# EAGLE design gs_mainboard_3 (EAGLE 7.5.0)
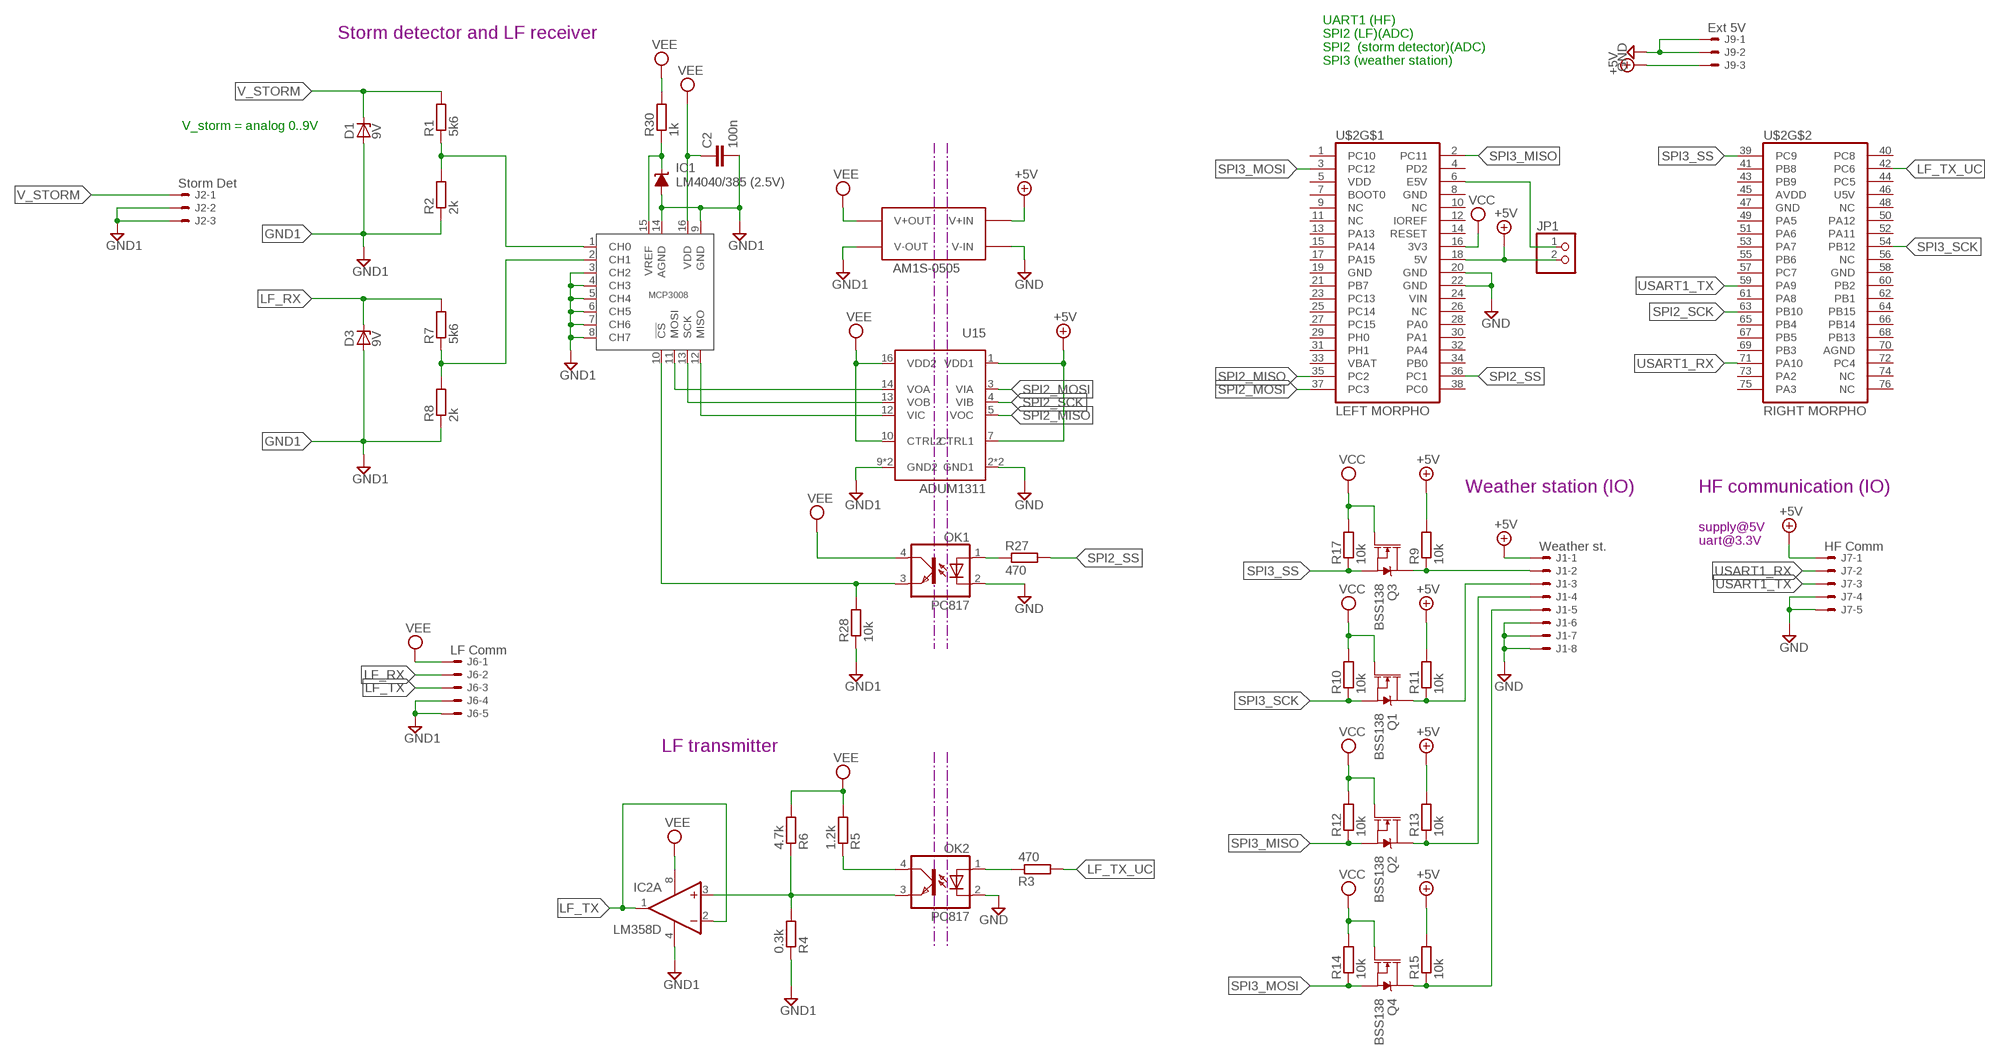
[diagram p0: schematic, sheet 1]

## Parts
C2  100n  C-EUC0805  [C0805]
D1  9V  ZENER-DIODESOT23  [SOT23]
D3  9V  ZENER-DIODESOT23  [SOT23]
IC1  LM4040/385 (2.5V)  LM4041A12DBZ  [DBZ_R-PDSO-G3]
IC2  LM358D  [SO08]
J1  Weather st.  22-05-7088-08  [7395-08]
J2  Storm Det  22-05-7038-03  [7395-03]
J6  LF Comm  22-05-7058-05  [7395-05]
J7  HF Comm  22-05-7058-05  [7395-05]
J9  Ext 5V  22-05-7038-03  [7395-03]
JP1  PINHD-1X2  [1X02]
OK1  PC817  [DIL04]
OK2  PC817  [DIL04]
Q1  BSS138  MOSFET-NCH-AO3404A  [SOT23-3]
Q2  BSS138  MOSFET-NCH-AO3404A  [SOT23-3]
Q3  BSS138  MOSFET-NCH-AO3404A  [SOT23-3]
Q4  BSS138  MOSFET-NCH-AO3404A  [SOT23-3]
R1  5k6  R-EU_R0805  [R0805]
R2  2k  R-EU_R0805  [R0805]
R3  470  R-EU_M0805  [M0805]
R4  0.3k  R-EU_M0805  [M0805]
R5  1.2k  R-EU_M0805  [M0805]
R6  4.7k  R-EU_M0805  [M0805]
R7  5k6  R-EU_R0805  [R0805]
R8  2k  R-EU_R0805  [R0805]
R9  10k  R-EU_M0805  [M0805]
R10  10k  R-EU_M0805  [M0805]
R11  10k  R-EU_M0805  [M0805]
R12  10k  R-EU_M0805  [M0805]
R13  10k  R-EU_M0805  [M0805]
R14  10k  R-EU_M0805  [M0805]
R15  10k  R-EU_M0805  [M0805]
R17  10k  R-EU_M0805  [M0805]
R27  470  R-EU_M0805  [M0805]
R28  10k  R-EU_M0805  [M0805]
R30  1k  R-EU_M0805  [M0805]
U13  MCP3008SL  [SO16]
U15  ADUM1311  [SOIC-16W]
U$2  NUCLEO_F411RE_MORPHO  [MORPHO_HEADERS]
U$14  AM1S-0505  [SIP4]

## Nets
+5V: J1.1 J7.1 J9.3 JP1.2 R9.2 R11.2 R13.2 R15.2 U15.1(VDD1) U15.7(CTRL1) U$2.18(5V) U$14.P$2(V+IN)
E5V: JP1.1 U$2.6(E5V)
GND: J1.6 J1.7 J1.8 J7.4 J7.5 J9.1 J9.2 OK1.2(C) OK2.2(C) U15.2(GND1) U15.8(GND1) U$2.20(GND) U$2.22(GND) U$14.P$1(V-IN)
GND1: C2.2 D1.1(A) D3.1(A) IC1.2(A) IC2.4(P:V-) J2.2 J2.3 J6.4 J6.5 R2.1 R4.1 R8.1 R28.1 U13.3(CH2) U13.4(CH3) U13.5(CH4) U13.6(CH5) U13.7(CH6) U13.8(CH7) U13.9(GND) U13.14(AGND) U15.9(GND2) U15.15(GND2) U$14.P$3(V-OUT)
LF_RX: D3.3(C) J6.2 R7.2
LF_TX: IC2.1(A:OUT) IC2.2(A:-IN) J6.3
LF_TX1: IC2.3(A:+IN) OK2.3(EMIT) R4.2 R6.1
LF_TX_UC: R3.2 U$2.42(PC6)
N$2: R7.1 R8.2 U13.2(CH1)
N$3: OK2.1(A) R3.1
N$5: OK2.4(COL) R5.1
N$7: R1.1 R2.2 U13.1(CH0)
N$18: IC1.1(C) R30.1 U13.15(VREF)
N$19: OK1.1(A) R27.1
N$21: OK1.3(EMIT) R28.2 U13.10(!CS)
N$23: U13.11(MOSI) U15.14(VOA)
N$24: U13.13(SCK) U15.13(VOB)
N$25: U13.12(MISO) U15.12(VIC)
SPI2_MISO: U15.5(VOC) U$2.35(PC2)
SPI2_MOSI: U15.3(VIA) U$2.37(PC3)
SPI2_SCK: U15.4(VIB) U$2.63(PB10)
SPI2_SS: R27.2 U$2.36(PC1)
SPI3_MISO: Q2.2(S) R12.1 U$2.2(PC11)
SPI3_MISO_EXT: J1.4 Q2.3(D) R13.1
SPI3_MOSI: Q4.2(S) R14.1 U$2.3(PC12)
SPI3_MOSI_EXT: J1.5 Q4.3(D) R15.1
SPI3_SCK: Q1.2(S) R10.1 U$2.54(PB12)
SPI3_SCK_EXT: J1.3 Q1.3(D) R11.1
SPI3_SS: Q3.2(S) R17.1 U$2.39(PC9)
SPI3_SS_EXT: J1.2 Q3.3(D) R9.1
USART1_RX: J7.2 U$2.71(PA10)
USART1_TX: J7.3 U$2.59(PA9)
V_STORM: D1.3(C) J2.1 R1.2
VCC: Q1.1(G) Q2.1(G) Q3.1(G) Q4.1(G) R10.2 R12.2 R14.2 R17.2 U$2.16(3V3)
VEE: C2.1 IC2.8(P:V+) J6.1 OK1.4(COL) R5.2 R6.2 R30.2 U13.16(VDD) U15.10(CTRL2) U15.16(VDD2) U$14.P$4(V+OUT)
Unconnected: IC2.5(B:+IN) IC2.6(B:-IN) IC2.7(B:OUT) U$2.1(PC10) U$2.4(PD2) U$2.7(BOOT0) U$2.9(NC) U$2.10(NC) U$2.11(NC) U$2.12(IOREF) U$2.13(PA13) U$2.14(RESET) U$2.15(PA14) U$2.17(PA15) U$2.21(PB7) U$2.23(PC13) U$2.25(PC14) U$2.26(NC) U$2.27(PC15) U$2.28(PA0) U$2.29(PH0) U$2.30(PA1) U$2.31(PH1) U$2.32(PA4) U$2.34(PB0) U$2.38(PC0) U$2.40(PC8) U$2.41(PB8) U$2.43(PB9) U$2.44(PC5) U$2.48(NC) U$2.49(PA5) U$2.50(PA12) U$2.51(PA6) U$2.52(PA11) U$2.53(PA7) U$2.55(PB6) U$2.56(NC) U$2.57(PC7) U$2.60(PB2) U$2.61(PA8) U$2.62(PB1) U$2.64(PB15) U$2.65(PB4) U$2.66(PB14) U$2.67(PB5) U$2.68(PB13) U$2.69(PB3) U$2.72(PC4) U$2.73(PA2) U$2.74(NC) U$2.75(PA3) U$2.76(NC)

## Notes on the sheet
- Storm detector and LF receiver
- UART1 (HF)
  SPI2 (LF)(ADC)
  SPI2  (storm detector)(ADC)
  SPI3 (weather station)
- V_storm = analog 0..9V
- Weather station (IO) | HF communication (IO)
- supply@5V 
  uart@3.3V
- LF transmitter

## Power pins joined to a net without a drawn wire
AGND: U$2.70(AGND)
AVDD: U$2.45(AVDD)
GND: U$2.8(GND) U$2.19(GND) U$2.47(GND) U$2.58(GND)
U5V: U$2.46(U5V)
VBAT: U$2.33(VBAT)
VDD: U$2.5(VDD)
VIN: U$2.24(VIN)

## Library data of the parts
C2 = rcl:C-EU: CAPACITOR, European symbol
D1 D3 = diode:ZENER-DIODE: Z-Diode
IC1 = texas:LM4041: PRECISION MICROPOWER SHUNT VOLTAGE REFERENCE Source: http://focus.ti.com/lit/ds/slcs146e/slcs146e.pdf; MPN: LM4041A12IDBZR; OC_FARNELL: 1407949; OC_NEWARK: 58K5875
IC2 = linear:LM358: OP AMP also LM158; LM258; LM2904 Source: http://cache.national.com/ds/LM/LM158.pdf
J1 = EP_molex_6410_7395:22-?-08: CONNECTOR wire to board 2.54 mm (.1 inch) pitch header
J2 J9 = EP_molex_6410_7395:22-?-03: CONNECTOR wire to board 2.54 mm (.1 inch) pitch header
J6 J7 = EP_molex_6410_7395:22-?-05: CONNECTOR wire to board 2.54 mm (.1 inch) pitch header
JP1 = pinhead:PINHD-1X2: PIN HEADER
OK1 OK2 = optocoupler:PC817: SHARP OPTO COUPLER; MPN: PC817X4J000F; OC_FARNELL: 9707727; OC_NEWARK: 97K7059
Q1-Q4 = SparkFun-DiscreteSemi:MOSFET-NCH: N-channel MOSFETs Voltage controlled devices that allow control of high current outputs. SparkFun Products: SparkFun OpenScale <https://www.sparkfun.com/products/13261> SparkFun Digital Sandbox <https://www.sparkfun.com/products/12651> SparkFun Monster Moto Shield <https://www.sparkfun.com/products/10182> SparkFun MOSFET Power Controller <https://www.sparkfun.com/products/11214>; PROD_ID: TRANS-12988; VALUE: 5.8A/30V/35mΩ
R1-R15 R17 R27 R28 R30 = rcl:R-EU_: RESISTOR, European symbol
U13 = MCP300x:MCP3008
U15 = adum:ADUM1311
U$2 = stm32_nucleo_shield:NUCLEO_F411RE_MORPHO
U$14 = am1s:AM1S-0505

## Board
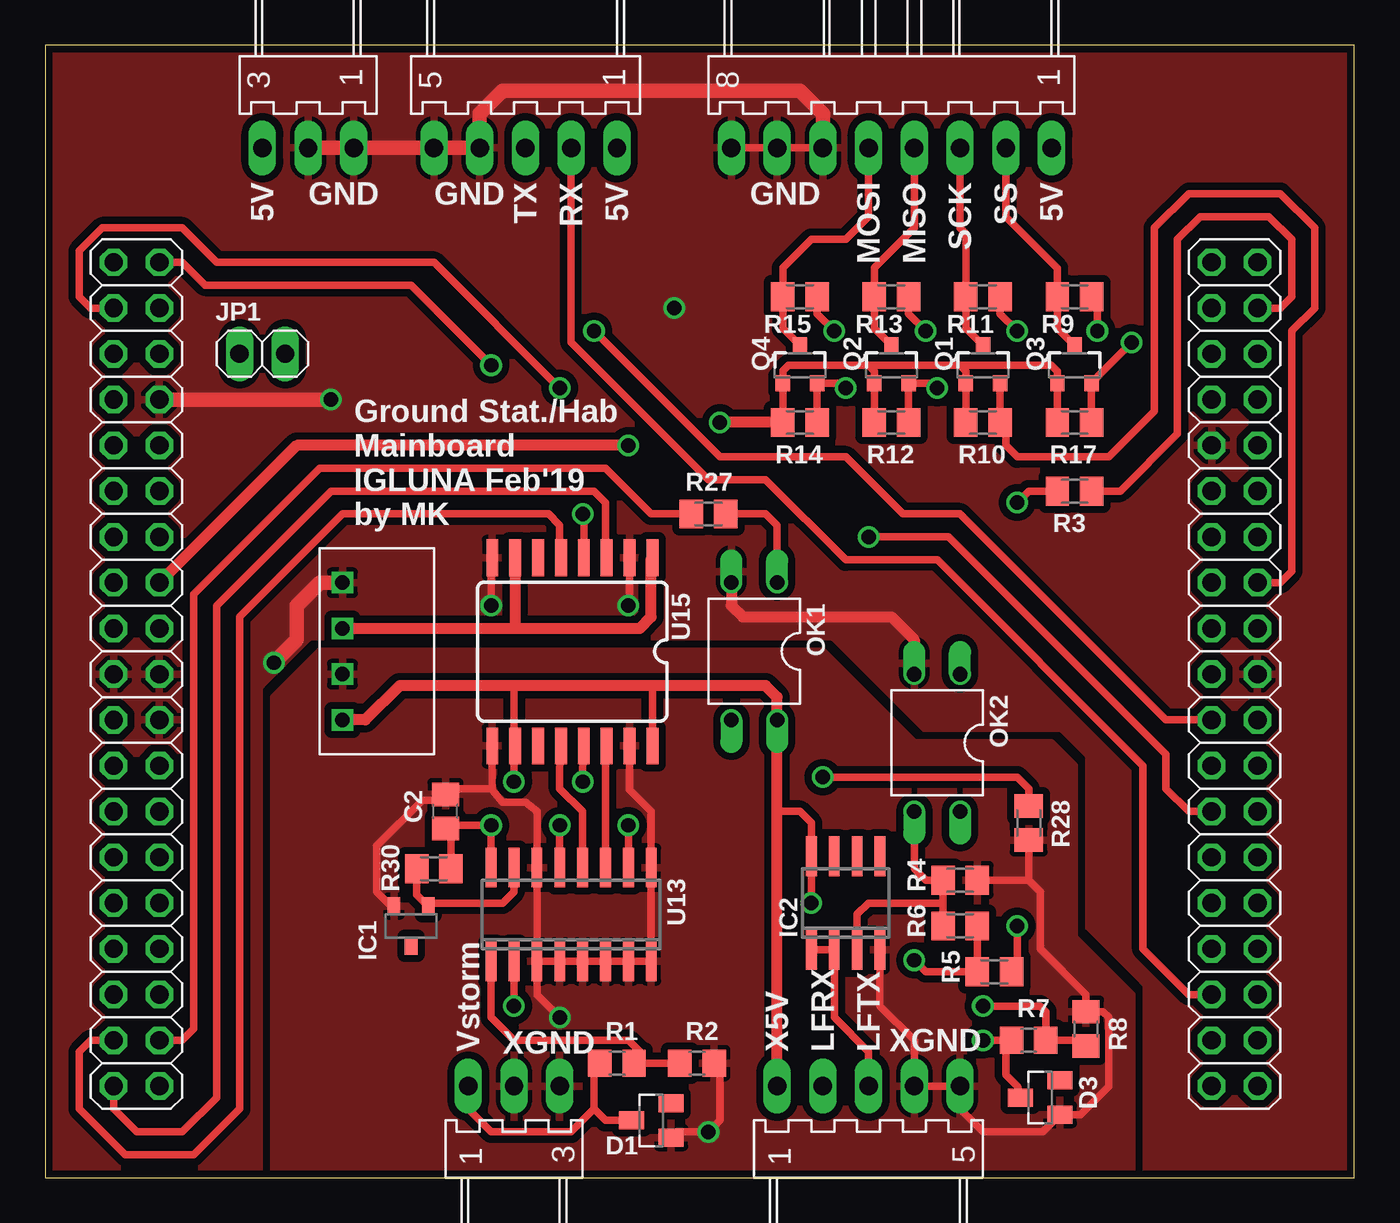
[diagram p1: board, top side]
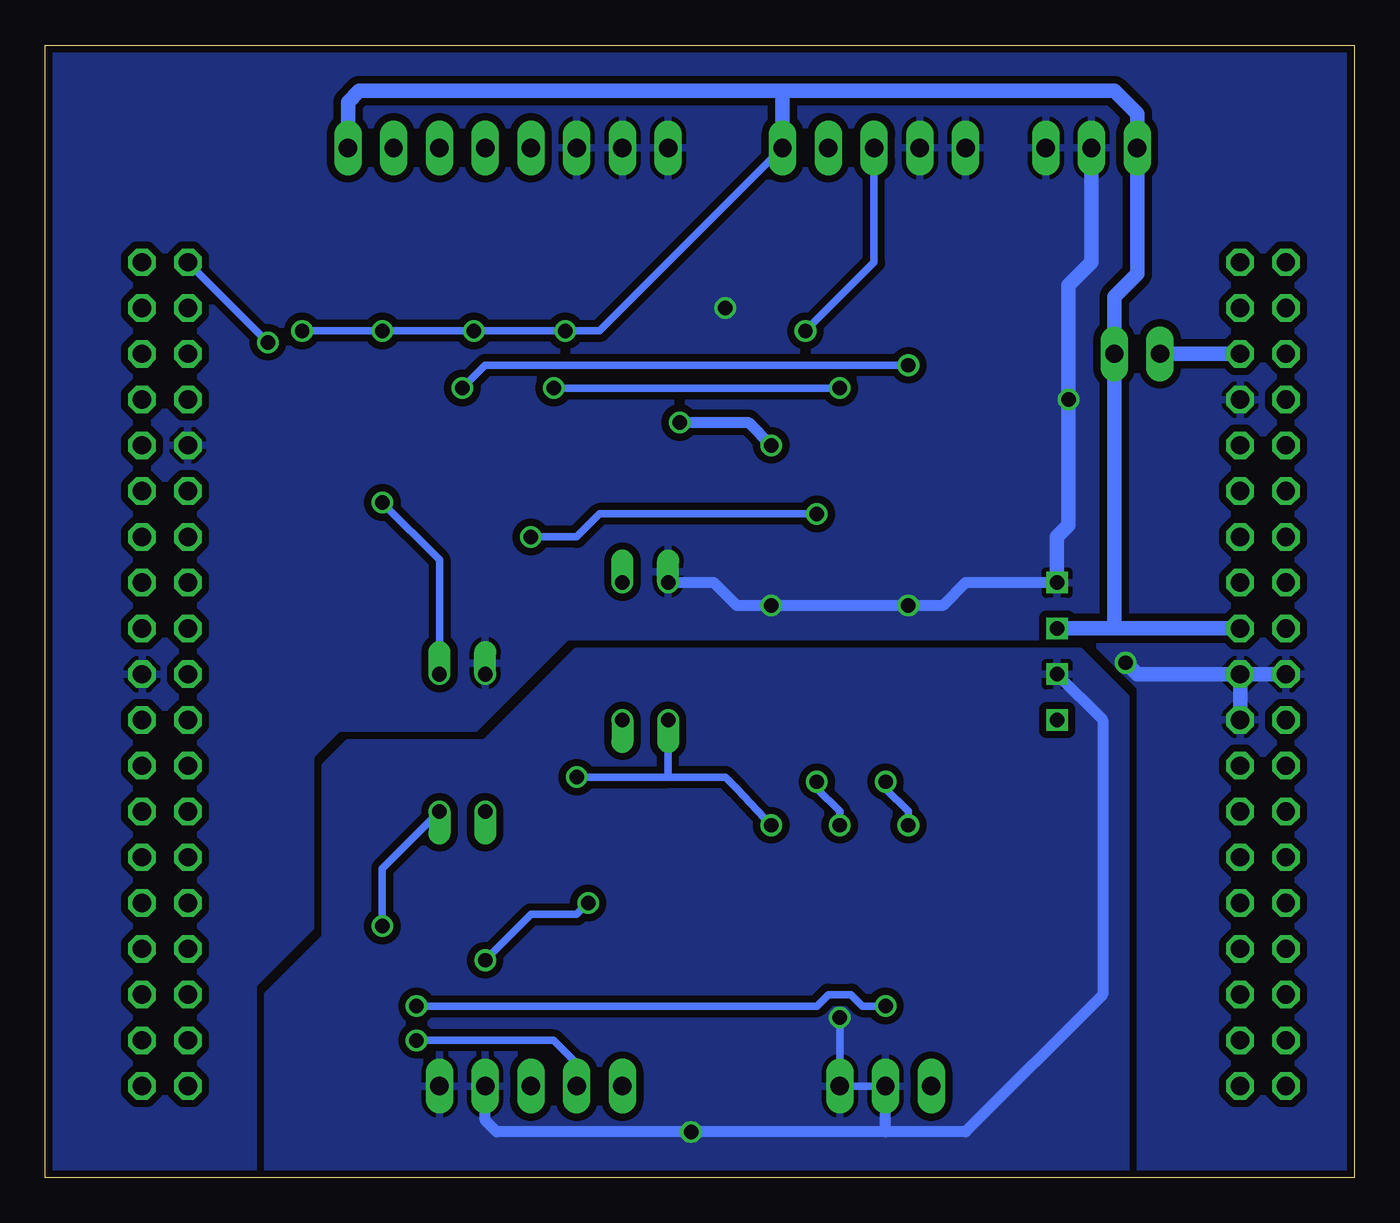
[diagram p2: board, bottom side, seen from below]

Size 72.69 x 62.85 mm. Coordinates in mm from the lower left corner, seen from the top.
Outline: 0,0 72.69,0 72.69,62.85 0,62.85 0,0
Copper layers (1*16): Top 0.035mm / dielectric 1.5mm / Bottom 0.035mm
Design rules "jlcpcb_rules": minimum track width 5mil, minimum drill 0.2mm, track to track 5mil, track to pad 5mil, pad to pad 5mil, via to via 5mil, smd to smd 5mil, copper to edge 0.2mm, drill to drill 12mil, minimum pad ring 3mil, minimum via ring 3mil, stop-mask expansion 4mil, vias tented up to drill 0mil, thermal gap 10mil

### Footprints (pad centres in the part's own frame; a part is rotated, then mirrored left to right if it is on the bottom)
C0805 = smd 1.3 x 1.5: 1 -0.95,0; 2 0.95,0
SOT23 = smd 1 x 1.4: 1 -0.95,-1.1; 2 0.95,-1.1; 3 0,1.1
DBZ_R-PDSO-G3 = smd 0.7 x 1: 1 -0.95,-1.1; 2 0.95,-1.1; 3 0,1.1
SO08 = smd 0.6 x 2.2: 1 -1.905,-2.6; 2 -0.635,-2.6; 3 0.635,-2.6; 4 1.905,-2.6; 5 1.905,2.6; 6 0.635,2.6; 7 -0.635,2.6; 8 -1.905,2.6
7395-08 = drill 1.016 long: 1 8.89,0; 2 6.35,0; 3 3.81,0; 4 1.27,0; 5 -1.27,0; 6 -3.81,0; 7 -6.35,0; 8 -8.89,0
7395-03 = drill 1.016 long: 1 2.54,0; 2 0,0; 3 -2.54,0
7395-05 = drill 1.016 long: 1 5.08,0; 2 2.54,0; 3 0,0; 4 -2.54,0; 5 -5.08,0
1X02 = drill 1.016 long: 1 -1.27,0; 2 1.27,0
DIL04 = drill 0.813 offset: 1 -1.27,-3.81; 2 1.27,-3.81; 3 1.27,3.81; 4 -1.27,3.81
SOT23-3 = smd 0.8 x 0.9: 1 -0.95,-1; 2 0.95,-1; 3 0,1.1
R0805 = smd 1.3 x 1.5: 1 -0.95,0; 2 0.95,0
M0805 = smd 1.3 x 1.6: 1 -0.95,0; 2 0.95,0
SO16 = smd 0.6 x 2.2: 1 -4.445,-2.6; 2 -3.175,-2.6; 3 -1.905,-2.6; 4 -0.635,-2.6; 5 0.635,-2.6; 6 1.905,-2.6; 7 3.175,-2.6; 8 4.445,-2.6; 9 4.445,2.6; 10 3.175,2.6; 11 1.905,2.6; 12 0.635,2.6; 13 -0.635,2.6; 14 -1.905,2.6; 15 -3.175,2.6; 16 -4.445,2.6
SOIC-16W = smd 0.66 x 2.032: 1 -1.335,-3.285; 2 -0.065,-3.285; 3 1.205,-3.285; 4 2.475,-3.285; 5 3.745,-3.285; 6 5.015,-3.285; 7 6.285,-3.285; 8 7.555,-3.285; 9 7.555,7.155; 10 6.285,7.155; 11 5.015,7.155; 12 3.745,7.155; 13 2.475,7.155; 14 1.205,7.155; 15 -0.065,7.155; 16 -1.335,7.155
MORPHO_HEADERS = drill 1.016 octagon: 1 -31.75,22.86; 2 -29.21,22.86; 3 -31.75,20.32; 4 -29.21,20.32; 5 -31.75,17.78; 6 -29.21,17.78; 7 -31.75,15.24; 8 -29.21,15.24; 9 -31.75,12.7; 10 -29.21,12.7; 11 -31.75,10.16; 12 -29.21,10.16; 13 -31.75,7.62; 14 -29.21,7.62; 15 -31.75,5.08; 16 -29.21,5.08; 17 -31.75,2.54; 18 -29.21,2.54; 19 -31.75,0; 20 -29.21,0; 21 -31.75,-2.54; 22 -29.21,-2.54; 23 -31.75,-5.08; 24 -29.21,-5.08; 25 -31.75,-7.62; 26 -29.21,-7.62; 27 -31.75,-10.16; 28 -29.21,-10.16; 29 -31.75,-12.7; 30 -29.21,-12.7; 31 -31.75,-15.24; 32 -29.21,-15.24; 33 -31.75,-17.78; 34 -29.21,-17.78; 35 -31.75,-20.32; 36 -29.21,-20.32; 37 -31.75,-22.86; 38 -29.21,-22.86; 39 29.21,22.86; 40 31.75,22.86; 41 29.21,20.32; 42 31.75,20.32; 43 29.21,17.78; 44 31.75,17.78; 45 29.21,15.24; 46 31.75,15.24; 47 29.21,12.7; 48 31.75,12.7; 49 29.21,10.16; 50 31.75,10.16; 51 29.21,7.62; 52 31.75,7.62; 53 29.21,5.08; 54 31.75,5.08; 55 29.21,2.54; 56 31.75,2.54; 57 29.21,0; 58 31.75,0; 59 29.21,-2.54; 60 31.75,-2.54; 61 29.21,-5.08; 62 31.75,-5.08; 63 29.21,-7.62; 64 31.75,-7.62; 65 29.21,-10.16; 66 31.75,-10.16; 67 29.21,-12.7; 68 31.75,-12.7; 69 29.21,-15.24; 70 31.75,-15.24; 71 29.21,-17.78; 72 31.75,-17.78; 73 29.21,-20.32; 74 31.75,-20.32; 75 29.21,-22.86; 76 31.75,-22.86
SIP4 = drill 0.8 square: P$1 1.27,0; P$2 3.81,0; P$3 6.35,0; P$4 8.89,0

### Placement (x,y rotation side)
C2  22.23,20.32 90 top
D1  33.66,3.17 90 top
D3  55.24,4.45 90 top
IC1  20.32,13.97 180 top
IC2  44.45,15.24 0 top
J1  46.99,57.15 0 top
J2  26.04,5.08 180 top
J6  45.72,5.08 180 top
J7  26.67,57.15 0 top
J9  14.61,57.15 0 top
JP1  12.06,45.72 0 top
OK1  39.37,29.21 180 top
OK2  49.53,24.13 180 top
Q1  52.07,45.09 0 top
Q2  46.99,45.09 0 top
Q3  57.15,45.09 0 top
Q4  41.91,45.09 0 top
R1  31.75,6.35 180 top
R2  36.2,6.35 180 top
R3  57.15,38.1 0 top
R4  50.8,16.51 180 top
R5  52.7,11.43 180 top
R6  50.8,13.97 0 top
R7  54.61,7.62 180 top
R8  57.78,8.26 270 top
R9  57.15,48.9 0 top
R10  52.07,41.91 180 top
R11  52.07,48.9 0 top
R12  46.99,41.91 180 top
R13  46.99,48.9 0 top
R14  41.91,41.91 180 top
R15  41.91,48.9 0 top
R17  57.15,41.91 180 top
R27  36.83,36.83 180 top
R28  54.61,19.68 90 top
R30  21.59,17.14 0 top
U13  29.21,14.61 0 top
U15  32.38,31.11 180 top
U$2  35.56,27.94 0 top
U$14  16.51,34.29 270 top

### Tracks (layer width: path | path; a pad name or v marks a point on that pad's centre or on a via)
+5V  (via drill 0.8)
  Top 0.406: 33.66,34.34 U15.1 | 26.1,30.55 26.04,30.48 | R15.2 42.86,47.95 v43.81,46.99 | v58.42,46.99 58.42,48.58 R9.2 | R13.2 47.94,47.95 v48.9,46.99 | R11.2 53.02,47.95 v53.98,46.99
  Top 0.61: 33.66,34.34 33.66,31.11 33.02,30.48 26.04,30.48 U$14.P$2 | U15.7 26.1,30.55
  Bottom 0.406: v58.42,46.99 v53.98,46.99 v48.9,46.99 v43.81,46.99 41.91,46.99 J7.1
  Bottom 0.813: U$14.P$2 13.34,30.48 | 13.34,30.48 U$2.18 | J1.1 55.88,59.69 55.24,60.33 31.75,60.33 | 13.34,30.48 JP1.2 13.34,48.9 12.06,50.16 J9.3 12.06,59.05 13.34,60.33 31.75,60.33 | 31.75,60.33 J7.1
E5V
  Bottom 0.813: U$2.6 JP1.1
GND  (via drill 0.8)
  Top 0.406: 24.72,34.29 24.77,34.34 | U15.2 32.45,31.82 | v24.77,31.75 24.77,34.34 | 24.77,34.34 U15.8 | J1.6 J1.7 J1.8
  Top 0.61: OK1.2 38.1,31.75 38.73,31.11 46.99,31.11 48.26,29.84 OK2.2
  Top 0.813: v12.7,28.57 13.97,29.84 13.97,31.75 15.24,33.02 U$14.P$1 | J9.2 J7.4 24.13,59.05 25.4,60.33 41.91,60.33 43.18,59.05 J1.6 | U$2.8 v15.88,43.18
  Bottom 0.61: OK1.2 35.56,33.02 34.29,31.75 22.86,31.75 21.59,33.02 U$14.P$1
  Bottom 0.813: U$2.20 12.06,27.94 v12.7,28.57 | U$2.19 U$2.20 | U$2.22 U$2.20 | J9.2 14.61,50.8 15.88,49.53 v15.88,43.18 15.88,36.2 16.51,35.56 U$14.P$1
  other vias: 32.38,31.75 34.92,48.26
  pour Bottom (isolate 0.406, rank 6): 0,0 0,62.87 73.03,62.87 73.03,0
  pour Top (isolate 0.406, rank 6): 0,0 0,62.87 73.03,62.87 73.03,0
GND1  (via drill 0.8)
  Top 0.406: IC2.4 46.35,9.53 48.26,7.62 J6.4 J6.5 50.8,3.81 52.07,2.54 55.39,2.54 D3.1 57.47,3.5 59.05,5.08 59.05,8.89 58.74,9.21 R8.1 57.78,10.16 55.24,12.7 55.24,15.88 54.61,16.51 | R4.1 54.61,16.51 | 54.61,16.51 R28.1 | v28.57,8.89 27.3,10.16 U13.3 | 27.3,15.88 U13.14 | U13.14 U13.3 | U15.15 32.45,21.52 33.66,20.32 U13.9 U13.8 U13.7 U13.6 U13.5 U13.4 U13.3 | U15.9 24.83,21.52 25.4,20.83 26.67,20.83 27.3,20.32 U13.14 | 37.47,6.67 R2.1 37.47,6.03 37.47,3.17 v36.83,2.54 35.07,2.54 D1.1 | 24.77,21.59 22.23,21.59 | IC1.2 19.22,15.07 18.41,15.88 18.41,18.41 20.95,20.95 21.91,20.95 C2.2
  Top 0.61: 22.23,21.59 C2.2
  Bottom 0.406: J2.2 J2.3 v28.57,8.89
  Bottom 0.61: 26.04,2.54 21.59,2.54 13.97,10.16 13.97,25.4 U$14.P$3 | 26.04,2.54 47.62,2.54 48.26,3.17 J6.4 | 26.04,2.54 J2.2
  pour Bottom (isolate 0.406): 12.7,0 12.7,26.67 15.24,29.21 43.18,29.21 48.26,24.13 55.88,24.13 57.15,22.86 57.15,13.34 60.33,10.16 60.33,0
  pour Top (isolate 0.406): 12.7,0 12.7,26.67 15.24,29.21 43.18,29.21 48.26,24.13 55.88,24.13 57.15,22.86 57.15,13.34 60.33,10.16 60.33,0
LF_RX  (via drill 0.8)
  Top 0.406: D3.3 53.98,5.08 53.34,5.71 53.34,7.3 R7.2 | v52.07,7.62 R7.2 | 53.98,7.62 R7.2
  Bottom 0.406: J6.2 43.18,6.35 44.45,7.62 v52.07,7.62
LF_TX
  Top 0.406: J6.3 45.72,6.99 43.81,8.89 IC2.2 IC2.1
LF_TX1
  Top 0.406: 49.85,15.24 R4.2 48.9,16.51 48.26,17.14 OK2.3 | 49.85,15.24 R6.1 | IC2.3 45.09,14.61 45.72,15.24 49.85,15.24
LF_TX_UC
  Top 0.406: U$2.42 68.58,48.26 69.22,48.9 69.22,52.07 67.94,53.34 64.14,53.34 62.87,52.07 62.87,41.27 59.69,38.1 R3.2
N$2  (via drill 0.8)
  Top 0.406: v52.07,9.53 55.24,9.53 55.56,9.21 R7.1 57.47,7.62 R8.2 | U13.2 v26.04,9.53
  Bottom 0.406: v52.07,9.53 29.84,9.53 29.21,10.16 27.94,10.16 27.3,9.53 v26.04,9.53
N$3  (via drill 0.8)
  Top 0.406: R3.1 54.61,38.1 v53.98,37.47
  Bottom 0.406: v53.98,37.47 50.8,34.29 OK2.1
N$5  (via drill 0.8)
  Top 0.406: v53.98,13.97 53.98,11.75 R5.1
  Bottom 0.406: OK2.4 53.98,17.14 v53.98,13.97
N$7
  Top 0.406: R2.2 R1.1 33.02,6.67 33.02,6.99 32.38,7.62 26.04,7.62 24.77,8.89 U13.1
N$18
  Top 0.406: U13.15 26.04,15.88 25.4,15.24 21.44,15.24 IC1.1 20.64,15.7 R30.1
N$19
  Top 0.406: R27.1 40.01,36.83 40.64,36.2 OK1.1
N$21  (via drill 0.8)
  Top 0.406: U13.10 v32.38,19.56 | R28.2 54.61,21.59 53.98,22.23 v43.18,22.23
  Bottom 0.406: v32.38,19.56 34.29,21.59 34.92,22.23 38.1,22.23 | 38.1,22.23 OK1.3 | v43.18,22.23 38.1,22.23
N$23
  Top 0.406: U13.11 31.11,22.62 U15.14
N$24  (via drill 0.8)
  Top 0.406: U13.13 v28.57,19.56 | v29.84,21.97 29.84,22.62 U15.13
  Bottom 0.406: v28.57,19.56 28.57,20.32 29.84,21.59 v29.84,21.97
N$25
  Top 0.406: U13.12 29.84,20.32 28.57,21.59 28.57,22.62 U15.12
SPI2_MISO
  Top 0.406: U$2.35 2.54,7.62 1.91,6.99 1.91,3.81 4.45,1.27 8.26,1.27 10.79,3.81 10.79,31.11 16.51,36.83 27.94,36.83 28.57,36.2 28.57,34.47 U15.5
SPI2_MOSI
  Top 0.406: U$2.37 3.81,3.81 5.08,2.54 7.62,2.54 9.53,4.45 9.53,31.75 15.88,38.1 30.48,38.1 31.11,37.47 31.11,34.47 U15.3
SPI2_SCK  (via drill 0.8)
  Top 0.406: U$2.63 63.5,20.32 62.23,21.59 62.23,23.5 50.16,35.56 v45.72,35.56 | U15.4 29.91,36.26 v29.84,36.83
  Bottom 0.406: v29.84,36.83 41.91,36.83 43.18,35.56 v45.72,35.56
SPI2_SS
  Top 0.406: U$2.36 7.62,7.62 8.26,8.26 8.26,32.38 15.24,39.37 31.11,39.37 33.66,36.83 R27.2
SPI3_MISO  (via drill 0.8)
  Top 0.406: R12.1 Q2.2 49.26,44.09 v49.53,43.81 | U$2.2 7.62,50.8 8.89,49.53 20.32,49.53 v24.77,45.09
  Bottom 0.406: v49.53,43.81 48.26,45.09 v24.77,45.09
SPI3_MISO_EXT
  Top 0.406: Q2.3 46.04,47.13 R13.1 46.04,50.48 48.26,52.7 J1.4
SPI3_MOSI  (via drill 0.8)
  Top 0.406: R14.1 Q4.2 44.18,44.09 v44.45,43.81 | v28.57,43.81 21.59,50.8 9.53,50.8 7.62,52.7 3.17,52.7 1.91,51.44 1.91,48.9 2.54,48.26 U$2.3
  Bottom 0.406: v44.45,43.81 v28.57,43.81
SPI3_MOSI_EXT
  Top 0.406: Q4.3 40.96,47.13 R15.1 40.96,50.48 42.55,52.07 44.45,52.07 45.72,53.34 J1.5
SPI3_SCK
  Top 0.406: Q1.2 R10.1 53.34,41.59 53.34,40.64 53.98,40.01 59.05,40.01 61.59,42.55 61.59,52.7 63.5,54.61 68.58,54.61 70.48,52.7 70.48,48.26 69.22,46.99 69.22,33.66 68.58,33.02 U$2.54
SPI3_SCK_EXT
  Top 0.406: Q1.3 51.12,47.13 R11.1 51.12,52.38 50.8,52.7 J1.3
SPI3_SS  (via drill 0.8)
  Top 0.406: R17.1 Q3.2 58.73,44.77 v60.33,46.35
  Bottom 0.406: v60.33,46.35 U$2.39
SPI3_SS_EXT
  Top 0.406: Q3.3 56.2,47.13 R9.1 56.2,50.48 53.34,53.34 J1.2
USART1_RX
  Top 0.406: U$2.71 63.5,10.16 60.96,12.7 60.96,22.86 49.53,34.29 44.45,34.29 40.01,38.73 36.83,38.73 29.21,46.35 J7.2
USART1_TX  (via drill 0.8)
  Top 0.406: U$2.59 62.23,25.4 50.8,36.83 47.62,36.83 44.45,40.01 37.47,40.01 v30.48,46.99
  Bottom 0.406: v30.48,46.99 26.67,50.8 J7.3
V_STORM
  Top 0.406: D1.3 31.11,3.17 30.48,3.81 | 30.48,3.81 30.48,6.03 R1.2 | J2.1 23.5,3.81 24.77,2.54 29.21,2.54 30.48,3.81
VCC  (via drill 0.8)
  Top 0.406: R14.2 Q4.1 40.96,44.77 41.27,45.09 45.72,45.09 | R12.2 Q2.1 46.04,44.77 45.72,45.09 | R10.2 Q1.1 51.12,44.77 50.8,45.09 | R17.2 Q3.1 56.2,44.77 55.88,45.09 50.8,45.09 | 50.8,45.09 45.72,45.09
  Top 0.61: R14.2 v37.47,41.91 | v32.38,40.64 13.97,40.64 U$2.16
  Bottom 0.61: v37.47,41.91 33.66,41.91 v32.38,40.64
VEE  (via drill 0.8)
  Top 0.406: R6.2 R5.2 48.9,11.43 v48.26,12.06 | U15.16 33.72,27.24 33.66,27.24 34.29,27.3 | 26.04,27.3 26.04,24.02 U15.10 26.04,23.89 v26.04,21.97 | 40.64,20.32 41.91,20.32 42.55,19.68 IC2.8 v42.55,15.24 | U13.16 v24.77,19.56 22.41,19.56 | 22.23,19.68 C2.1 22.54,19.05 R30.2
  Top 0.61: 22.41,19.56 C2.1 | U$14.P$4 17.78,25.4 19.68,27.3 26.04,27.3 34.29,27.3 40.01,27.3 40.64,26.67 OK1.4 40.64,20.32 J6.1
  Bottom 0.406: v24.77,19.56 24.77,20.32 26.04,21.59 v26.04,21.97 | v48.26,12.06 45.72,14.61 43.18,14.61 v42.55,15.24

### Text on the board
tNames: 5V | TX | RX | 5V | MOSI | MISO | SCK | SS | 5V | GND | GND | GND | Ground Stat./Hab / Mainboard / IGLUNA Feb'19 / by MK | Vstorm | XGND | X5V | LFRX | LFTX | XGND